# EAGLE design LED panel (EAGLE 6.6.0)
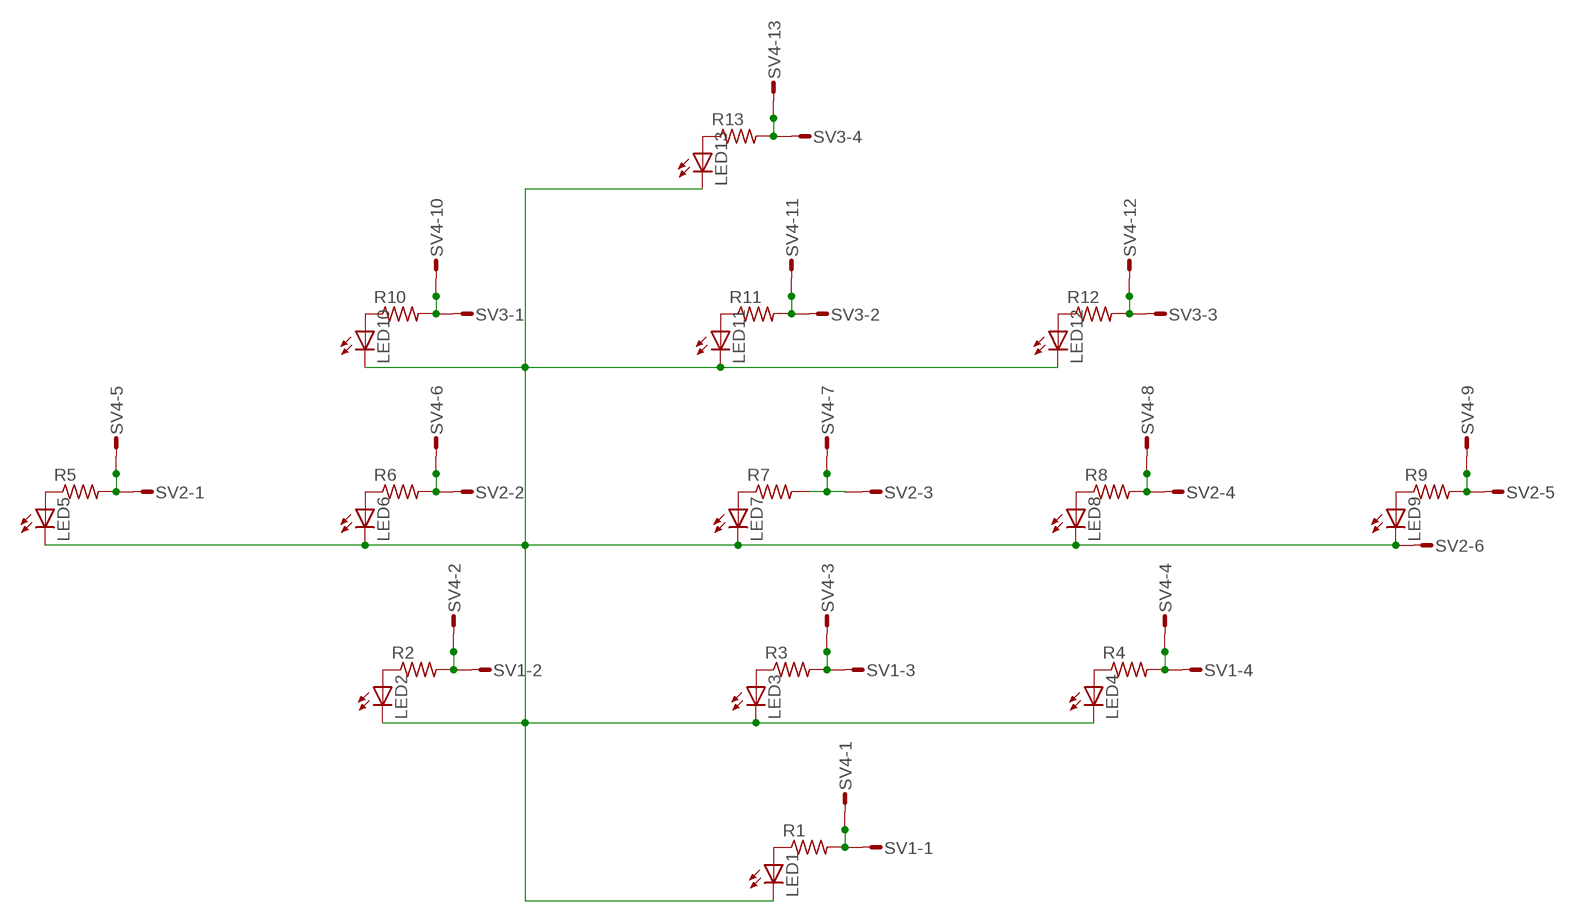
[diagram p0: schematic, sheet 1]

## Parts
LED1  LED5MM  [LED5MM]
LED2  LED5MM  [LED5MM]
LED3  LED5MM  [LED5MM]
LED4  LED5MM  [LED5MM]
LED5  LED5MM  [LED5MM]
LED6  LED5MM  [LED5MM]
LED7  LED5MM  [LED5MM]
LED8  LED5MM  [LED5MM]
LED9  LED5MM  [LED5MM]
LED10  LED5MM  [LED5MM]
LED11  LED5MM  [LED5MM]
LED12  LED5MM  [LED5MM]
LED13  LED5MM  [LED5MM]
R1  R-US_0204/5  [0204/5]
R2  R-US_0204/5  [0204/5]
R3  R-US_0204/5  [0204/5]
R4  R-US_0204/5  [0204/5]
R5  R-US_0204/5  [0204/5]
R6  R-US_0204/5  [0204/5]
R7  R-US_0204/5  [0204/5]
R8  R-US_0204/5  [0204/5]
R9  R-US_0204/5  [0204/5]
R10  R-US_0204/5  [0204/5]
R11  R-US_0204/5  [0204/5]
R12  R-US_0204/5  [0204/5]
R13  R-US_0204/5  [0204/5]
SV1  L04P  [L04P]
SV2  L06P  [L06P]
SV3  L04P  [L04P]
SV4  L13P  [L13P]

## Nets
N$1: LED1.A R1.1
N$2: LED2.A R2.1
N$3: LED1.K(C) LED2.K(C) LED3.K(C) LED4.K(C) LED5.K(C) LED6.K(C) LED7.K(C) LED8.K(C) LED9.K(C) LED10.K(C) LED11.K(C) LED12.K(C) LED13.K(C) SV2.6
N$4: LED3.A R3.1
N$5: LED4.A R4.1
N$6: LED5.A R5.1
N$7: LED6.A R6.1
N$8: LED7.A R7.1
N$9: LED8.A R8.1
N$10: LED9.A R9.1
N$11: LED10.A R10.1
N$12: R11.2 SV3.2 SV4.11
N$13: LED12.A R12.1
N$14: LED13.A R13.1
N$28: R13.2 SV3.4 SV4.13
N$29: R10.2 SV3.1 SV4.10
N$30: LED11.A R11.1
N$31: R12.2 SV3.3 SV4.12
N$32: R9.2 SV2.5 SV4.9
N$33: R8.2 SV2.4 SV4.8
N$34: R7.2 SV2.3 SV4.7
N$35: R6.2 SV2.2 SV4.6
N$36: R5.2 SV2.1 SV4.5
N$37: R2.2 SV1.2 SV4.2
N$38: R3.2 SV1.3 SV4.3
N$39: R4.2 SV1.4 SV4.4
N$40: R1.2 SV1.1 SV4.1

## Library data of the parts
LED1-LED13 = led:LED: LED OSRAM: - CHIPLED LG R971, LG N971, LY N971, LG Q971, LY Q971, LO R971, LY R971 LH N974, LH R974 LS Q976, LO Q976, LY Q976 LO Q996 - Hyper CHIPLED LW Q18S LB Q993, LB Q99A, LB R99A - SideLED LS A670, LO A670, LY A670, LG A670, LP A670 LB A673, LV A673, LT A673, LW A673 LH A674 LY A675 LS A676, LA A676, LO A676, LY A676, LW A676 LS A679, LY A679, LG A679 - Hyper Micro SIDELED® LS Y876, LA Y876, LO Y876, LY Y876 LT Y87S - SmartLED LW L88C, LW L88S LB L89C, LB L89S, LG L890 LS L89K, LO L89K, LY L89K LS L896, LA L896, LO L896, LY L896 - TOPLED LS T670, LO T670, LY T670, LG T670, LP T670 LSG T670, LSP T670, LSY T670, LOP T670, LYG T670 LG T671, LOG T671, LSG T671 LB T673, LV T673, LT T673, LW T673 LH T674 LS T676, LA T676, LO T676, LY T676, LB T676, LH T676, LSB T676, LW T676 LB T67C, LV T67C, LT T67C, LS T67K, LO T67K, LY T67K, LW E67C LS E67B, LA E67B, LO E67B, LY E67B, LB E67C, LV E67C, LT E67C LW T67C LS T679, LY T679, LG T679 LS T770, LO T770, LY T770, LG T770, LP T770 LB T773, LV T773, LT T773, LW T773 LH T774 LS E675, LA E675, LY E675, LS T675 LS T776, LA T776, LO T776, LY T776, LB T776 LHGB T686 LT T68C, LB T68C - Hyper Mini TOPLED® LB M676 - Mini TOPLED Santana® LG M470 LS M47K, LO M47K, LY M47K Source: http://www.osram.convergy.de LUXEON: - LUMILED® LXK2-PW12-R00, LXK2-PW12-S00, LXK2-PW14-U00, LXK2-PW14-V00 LXK2-PM12-R00, LXK2-PM12-S00, LXK2-PM14-U00 LXK2-PE12-Q00, LXK2-PE12-R00, LXK2-PE12-S00, LXK2-PE14-T00, LXK2-PE14-U00 LXK2-PB12-K00, LXK2-PB12-L00, LXK2-PB12-M00, LXK2-PB14-N00, LXK2-PB14-P00, LXK2-PB14-Q00 LXK2-PR12-L00, LXK2-PR12-M00, LXK2-PR14-Q00, LXK2-PR14-R00 LXK2-PD12-Q00, LXK2-PD12-R00, LXK2-PD12-S00 LXK2-PH12-R00, LXK2-PH12-S00 LXK2-PL12-P00, LXK2-PL12-Q00, LXK2-PL12-R00 Source: www.luxeon.com KINGBRIGHT: KA-3528ASYC Source: www.kingbright.com
R1-R13 = resistor:R-US_: RESISTOR, American symbol
SV1 SV3 = con-amp-mt:L04P: AMP MT CONNECTOR; OC_FARNELL: unknown; OC_NEWARK: unknown
SV2 = con-amp-mt:L06P: AMP MT CONNECTOR; OC_FARNELL: unknown; OC_NEWARK: unknown
SV4 = con-amp-mt:L13P: AMP MT CONNECTOR; OC_FARNELL: unknown; OC_NEWARK: unknown

## Board
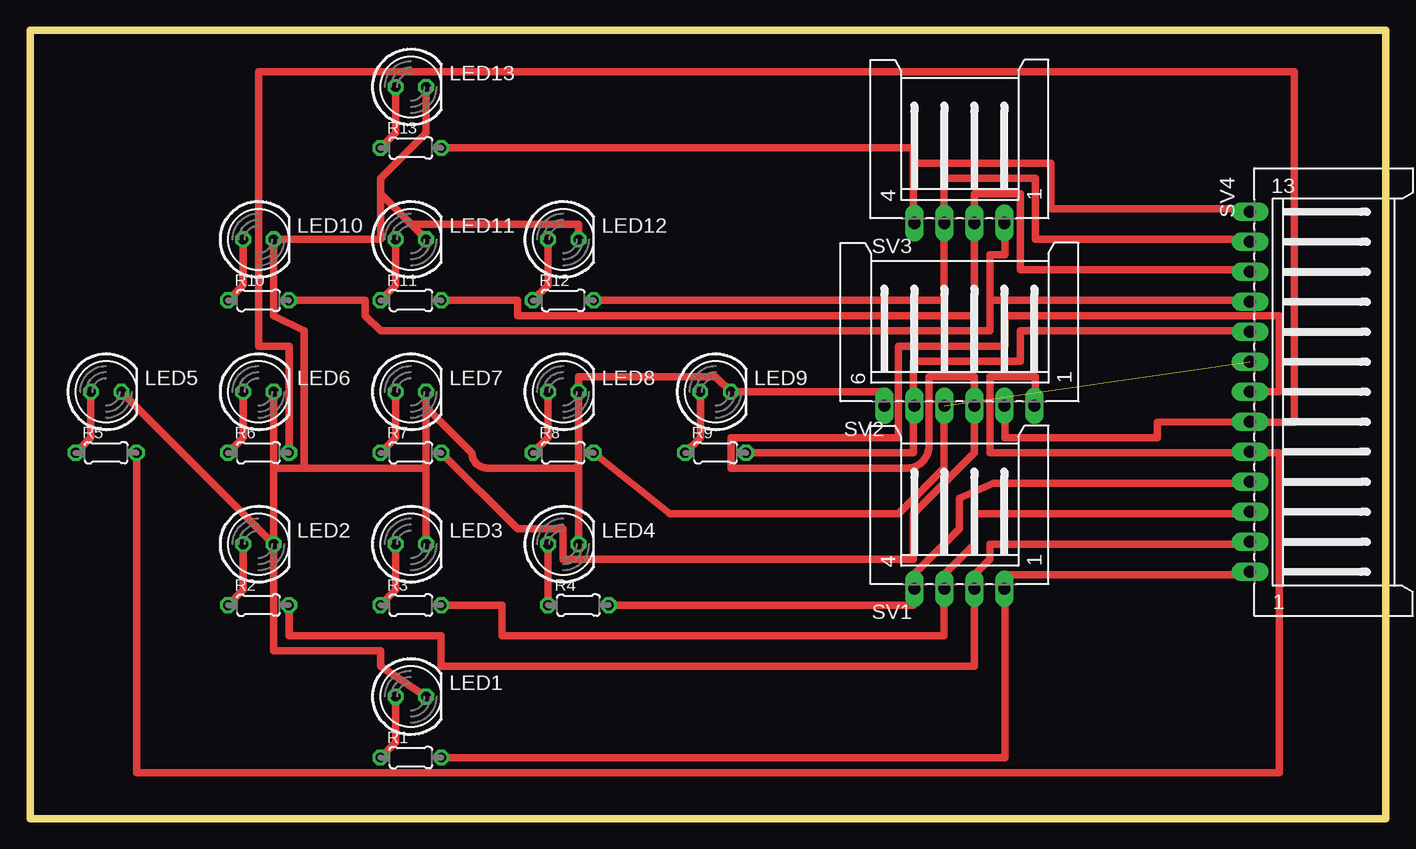
[diagram p1: board, top side]

Size 113.01 x 65.71 mm. Coordinates in mm from the lower left corner, seen from the top.
Outline: 0,0 113.01,0 113.01,65.71 0,65.71 0,0
Copper layers (1*16): Top 0.035mm / dielectric 1.5mm / Bottom 0.035mm
Design rules "default": minimum track width 10mil, minimum drill 24mil, track to track 8mil, track to pad 8mil, pad to pad 8mil, via to via 8mil, smd to smd 8mil, copper to edge 40mil, drill to drill 8mil, minimum pad ring 10mil, minimum via ring 8mil, stop-mask expansion 4mil, vias tented up to drill 0mil, thermal gap 10mil

### Footprints (pad centres in the part's own frame; a part is rotated, then mirrored left to right if it is on the bottom)
LED5MM = drill 0.813 octagon: A -1.27,0; K 1.27,0
0204/5 = drill 0.813 octagon: 1 -2.54,0; 2 2.54,0
L04P = drill 1.016 long: 1 3.75,-6.25; 2 1.25,-6.25; 3 -1.25,-6.25; 4 -3.75,-6.25
L06P = drill 1.016 long: 1 6.25,-6.25; 2 3.75,-6.25; 3 1.25,-6.25; 4 -1.25,-6.25; 5 -3.75,-6.25; 6 -6.25,-6.25
L13P = drill 1.016 long: 1 15,-6.25; 2 12.5,-6.25; 3 10,-6.25; 4 7.5,-6.25; 5 5,-6.25; 6 2.5,-6.25; 7 0,-6.25; 8 -2.5,-6.25; 9 -5,-6.25; 10 -7.5,-6.25; 11 -10,-6.25; 12 -12.5,-6.25; 13 -15,-6.25

### Placement (x,y rotation side)
LED1  31.75,10.16 0 top
LED2  19.05,22.86 0 top
LED3  31.75,22.86 0 top
LED4  44.45,22.86 0 top
LED5  6.35,35.56 0 top
LED6  19.05,35.56 0 top
LED7  31.75,35.56 0 top
LED8  44.45,35.56 0 top
LED9  57.15,35.56 0 top
LED10  19.05,48.26 0 top
LED11  31.75,48.26 0 top
LED12  44.45,48.26 0 top
LED13  31.75,60.96 0 top
R1  31.75,5.08 0 top
R2  19.05,17.78 0 top
R3  31.75,17.78 0 top
R4  45.72,17.78 0 top
R5  6.35,30.48 0 top
R6  19.05,30.48 0 top
R7  31.75,30.48 0 top
R8  44.45,30.48 0 top
R9  57.15,30.48 0 top
R10  19.05,43.18 0 top
R11  31.75,43.18 0 top
R12  44.45,43.18 0 top
R13  31.75,55.88 0 top
SV1  77.47,25.4 0 top
SV2  77.47,40.64 0 top
SV3  77.47,55.88 0 top
SV4  107.95,35.56 270 top

### Tracks (layer width: path | path; a pad name or v marks a point on that pad's centre or on a via)
N$1
  Top 0.61: R1.1 30.48,6.35 LED1.A
N$2
  Top 0.61: R2.1 17.78,19.05 LED2.A
N$3
  Top 0.61: 29.21,52.07 29.21,53.34 33.02,57.15 LED13.K | 29.21,52.07 29.21,48.26 LED10.K 20.32,41.91 22.86,40.64 22.86,39.37 22.86,29.21 | 29.21,52.07 31.75,49.53 | 31.75,49.53 LED11.K | LED12.K 45.72,49.53 31.75,49.53 | SV2.6 71.12,35.56 LED9.K 57.15,36.83 45.72,36.83 LED8.K 45.72,29.21 | 45.72,29.21 LED4.K | LED7.K 33.02,34.29 | 33.02,34.29 33.02,29.21 | 33.02,29.21 LED3.K | LED6.K 20.32,29.21 | 20.32,29.21 LED2.K | LED1.K 29.21,12.7 29.21,13.97 26.67,13.97 20.32,13.97 LED2.K | LED2.K LED5.K | 20.32,29.21 22.86,29.21 | 22.86,29.21 33.02,29.21 | 45.72,29.21 38.1,29.21 arc-90 36.83,30.48 33.02,34.29
N$4
  Top 0.61: R3.1 30.48,19.05 LED3.A
N$5
  Top 0.61: LED4.A R4.1
N$6
  Top 0.61: R5.1 5.08,31.75 LED5.A
N$7
  Top 0.61: R6.1 17.78,31.75 LED6.A
N$8
  Top 0.61: R7.1 30.48,31.75 30.48,33.02 LED7.A
N$9
  Top 0.61: R8.1 43.18,31.75 LED8.A
N$10
  Top 0.61: R9.1 55.88,31.75 LED9.A
N$11
  Top 0.61: R10.1 17.78,44.45 LED10.A
N$12
  Top 0.61: R11.2 40.64,43.18 40.64,41.91 78.74,41.91 78.74,49.53 SV3.2 78.74,50.8 78.74,52.07 81.28,52.07 82.55,52.07 82.55,50.8 82.55,45.72 101.6,45.72 SV4.11
N$13
  Top 0.61: R12.1 43.18,44.45 LED12.A
N$14
  Top 0.61: R13.1 30.48,57.15 LED13.A
N$28
  Top 0.61: R13.2 73.66,55.88 73.66,54.61 | 73.66,54.61 73.66,50.8 SV3.4 | 73.66,54.61 81.28,54.61 85.09,54.61 85.09,50.8 101.6,50.8 SV4.13
N$29
  Top 0.61: R10.2 27.94,43.18 27.94,41.91 29.21,40.64 80.01,40.64 80.01,43.18 | 80.01,43.18 80.01,46.99 81.28,46.99 81.28,49.53 SV3.1 | 80.01,43.18 101.6,43.18 SV4.10
N$30
  Top 0.61: R11.1 30.48,44.45 LED11.A
N$31
  Top 0.61: R12.2 76.2,43.18 76.2,49.53 SV3.3 76.2,50.8 76.2,53.34 81.28,53.34 83.82,53.34 83.82,50.8 83.82,48.26 101.6,48.26 SV4.12
N$32
  Top 0.61: R9.2 73.66,30.48 73.66,34.29 SV2.5 73.66,35.56 73.66,38.1 80.01,38.1 82.55,38.1 82.55,40.64 101.6,40.64 SV4.9
N$33  (1 unrouted)
  Top 0.61: R8.2 53.34,25.4 72.39,25.4 76.2,29.21 76.2,34.29 SV2.4
N$34
  Top 0.61: 101.6,35.56 SV4.7 104.14,35.56 104.14,41.91 81.28,41.91 81.28,39.37 72.39,39.37 72.39,33.02 72.39,31.75 71.12,31.75 58.42,31.75 58.42,29.21 73.13,29.21 arc90 74.93,31.01 74.93,36.83 78.74,36.83 78.74,35.56 SV2.3 78.74,34.29 78.74,30.48 73.66,25.4 73.66,21.59 44.45,21.59 44.45,24.13 40.64,24.13 R7.2
N$35
  Top 0.61: R6.2 21.59,39.37 19.05,39.37 19.05,62.23 105.41,62.23 105.41,33.02 102.87,33.02 SV4.6 93.98,33.02 93.98,31.75 81.28,31.75 81.28,34.29 SV2.2
N$36
  Top 0.61: R5.2 8.89,3.81 104.14,3.81 104.14,29.21 104.14,30.48 102.87,30.48 SV4.5 101.6,30.48 82.55,30.48 80.01,30.48 80.01,33.02 80.01,36.83 83.82,36.83 83.82,35.56 SV2.1
N$37
  Top 0.61: R2.2 21.59,15.24 34.29,15.24 34.29,12.7 78.74,12.7 78.74,19.05 SV1.2 78.74,20.32 80.01,21.59 80.01,22.86 101.6,22.86 SV4.2
N$38
  Top 0.61: R3.2 39.37,17.78 39.37,15.24 76.2,15.24 76.2,19.05 SV1.3 76.2,20.32 78.74,22.86 78.74,25.4 101.6,25.4 SV4.3
N$39
  Top 0.61: R4.2 73.66,17.78 73.66,19.05 SV1.4 73.66,20.32 77.47,24.13 77.47,25.1 77.47,26.67 80.31,27.94 101.6,27.94 SV4.4
N$40
  Top 0.61: R1.2 81.28,5.08 81.28,19.05 SV1.1 81.28,20.32 101.6,20.32 SV4.1